# EAGLE schematic thinkingcap10a (EAGLE 6.2)
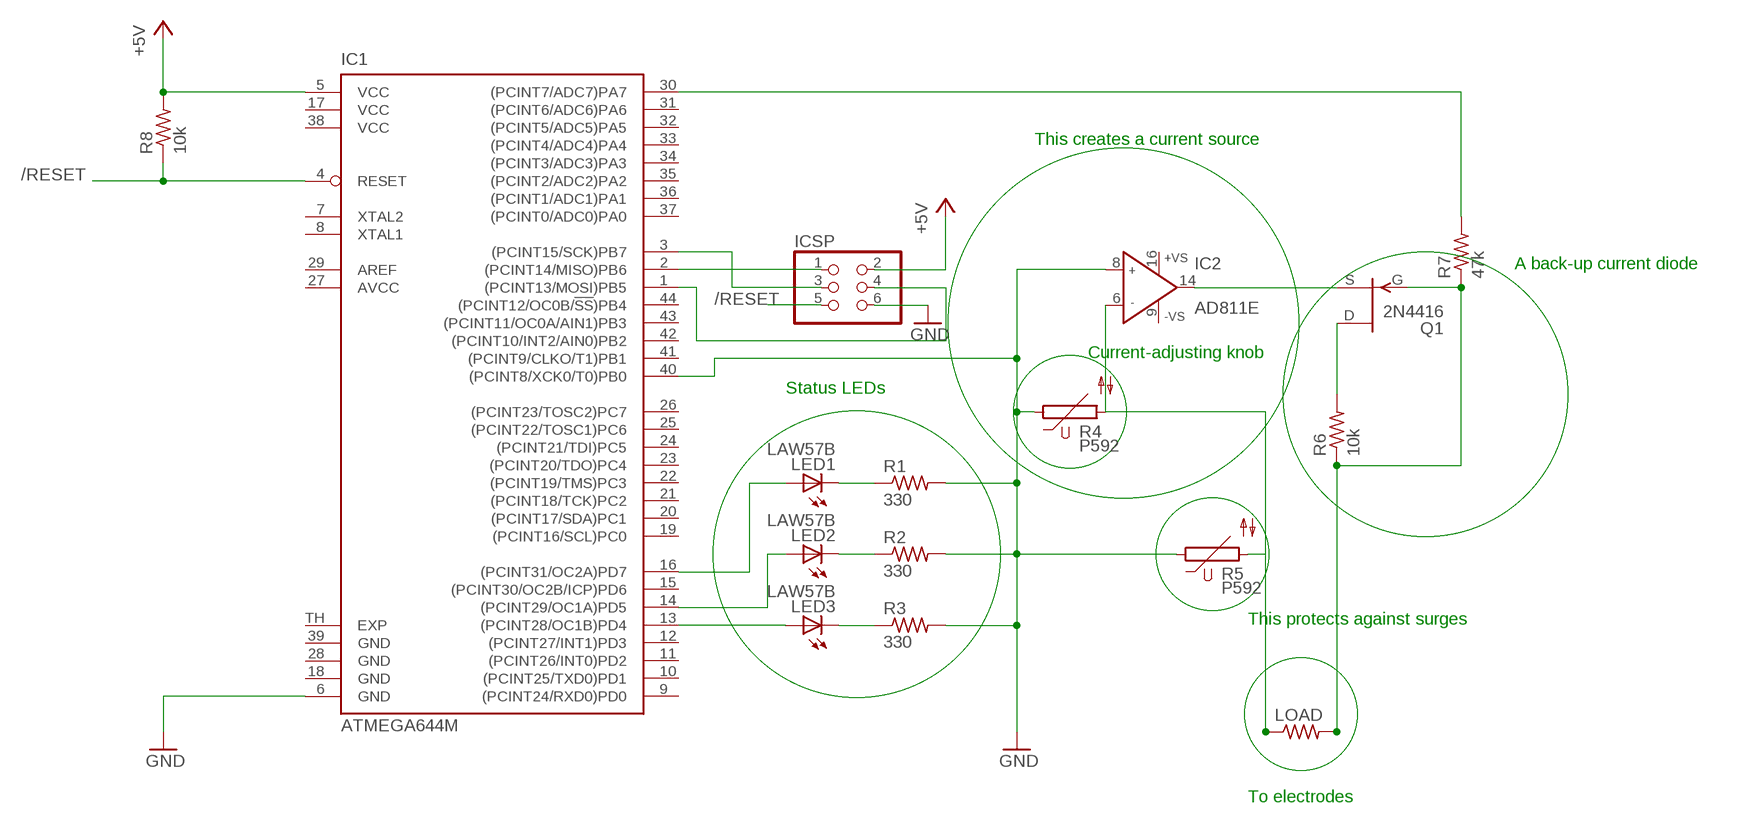
[diagram p0: schematic, sheet 1]

## Parts
IC1  ATMEGA644M  [MLF44-TH]
IC2  AD811E  [PLCC20]
ICSP  PINHD-2X3/90  [2X03/90]
LED1  LAW57B  [W57B]
LED2  LAW57B  [W57B]
LED3  LAW57B  [W57B]
LOAD  R-US_0204/2V  [0204V]
Q1  2N4416  [TO72]
R1  330  R-US_0204/2V  [0204V]
R2  330  R-US_0204/2V  [0204V]
R3  330  R-US_0204/2V  [0204V]
R4  P592  [P592]
R5  P592  [P592]
R6  10k  R-US_0204/2V  [0204V]
R7  47k  R-US_0204/2V  [0204V]
R8  10k  R-US_0204/2V  [0204V]

## Nets
+5V: IC1.5(VCC) ICSP.2 R8.2
/RESET: IC1.4(RESET) ICSP.5 R8.1
GND: IC1.6(GND) IC1.40((PCINT8/XCK0/T0)PB0) IC2.8(IN+) ICSP.6 R1.2 R2.2 R3.2
N$1: IC1.13((PCINT28/OC1B)PD4) LED3.A
N$2: IC1.14((PCINT29/OC1A)PD5) LED2.A
N$3: IC1.16((PCINT31/OC2A)PD7) LED1.A
N$4: LED1.C LED1.C@1(C) LED1.C@2(C) LED1.C@3(C) LED1.C@4(C) LED1.C@5(C) R1.1
N$5: LED2.C LED2.C@1(C) LED2.C@2(C) LED2.C@3(C) LED2.C@4(C) LED2.C@5(C) R2.1
N$6: LED3.C LED3.C@1(C) LED3.C@2(C) LED3.C@3(C) LED3.C@4(C) LED3.C@5(C) R3.1
N$7: IC1.2((PCINT14/MISO)PB6) ICSP.1
N$8: IC2.6(IN-) LOAD.1
N$9: IC2.14(OUT) Q1.1(S)
N$10: Q1.2(D) R6.2
N$11: IC1.30((PCINT7/ADC7)PA7) R7.2
N$12: LOAD.2 Q1.3(G) R6.1 R7.1
N$13: IC1.3((PCINT15/SCK)PB7) ICSP.3
N$14: IC1.1((PCINT13/MOSI)PB5) ICSP.4
Unconnected: IC1.7(XTAL2) IC1.8(XTAL1) IC1.9((PCINT24/RXD0)PD0) IC1.10((PCINT25/TXD0)PD1) IC1.11((PCINT26/INT0)PD2) IC1.12((PCINT27/INT1)PD3) IC1.15((PCINT30/OC2B/ICP)PD6) IC1.19((PCINT16/SCL)PC0) IC1.20((PCINT17/SDA)PC1) IC1.21((PCINT18/TCK)PC2) IC1.22((PCINT19/TMS)PC3) IC1.23((PCINT20/TDO)PC4) IC1.24((PCINT21/TDI)PC5) IC1.25((PCINT22/TOSC1)PC6) IC1.26((PCINT23/TOSC2)PC7) IC1.29(AREF) IC1.31((PCINT6/ADC6)PA6) IC1.32((PCINT5/ADC5)PA5) IC1.33((PCINT4/ADC4)PA4) IC1.34((PCINT3/ADC3)PA3) IC1.35((PCINT2/ADC2)PA2) IC1.36((PCINT1/ADC1)PA1) IC1.37((PCINT0/ADC0)PA0) IC1.41((PCINT9/CLKO/T1)PB1) IC1.42((PCINT10/INT2/AIN0)PB2) IC1.43((PCINT11/OC0A/AIN1)PB3) IC1.44((PCINT12/OC0B/!SS!)PB4) IC2.9(-VS) IC2.16(+VS) R4.1 R4.2 R5.1 R5.2

## Notes on the sheet
- This creates a current source
- A back-up current diode
- Current-adjusting knob
- Status LEDs
- This protects against surges
- To electrodes

## Power pins joined to a net without a drawn wire
AVCC: IC1.27(AVCC)
EXP: IC1.TH(EXP)
GND: IC1.18(GND) IC1.28(GND) IC1.39(GND)
VCC: IC1.17(VCC) IC1.38(VCC)

## Library data of the parts
IC1 = atmel:ATMEGA644*: 8-bit Microcontroller with 64K Bytes In-System Programmable Flash Source: http://www.atmel.com/dyn/resources/prod_documents/doc2593.pdf; MPN: ATMEGA644P-20MU; OC_FARNELL: 1748528; OC_NEWARK: 26R5636
IC2 = analog-devices:AD811: High Performance Video Op Amp Source: http://www.analog.com/static/imported-files/data_sheets/AD811.pdf; OC_FARNELL: unknown; OC_NEWARK: unknown
ICSP = pinhead:PINHD-2X3: PIN HEADER
LED1-LED3 = led:*W57B: Golden Dragon® 1 Watt LED Place heat sink pads of cathode with INVOKE Source: www.osram-os.com la_ly_w57b.pdf
LOAD R1-R3 R6-R8 = rcl:R-US_: RESISTOR, American symbol
Q1 = transistor-fet:2N4416: N-Channel JFET Source: www.vishay.com
R4 R5 = varistor:P592: VARISTOR